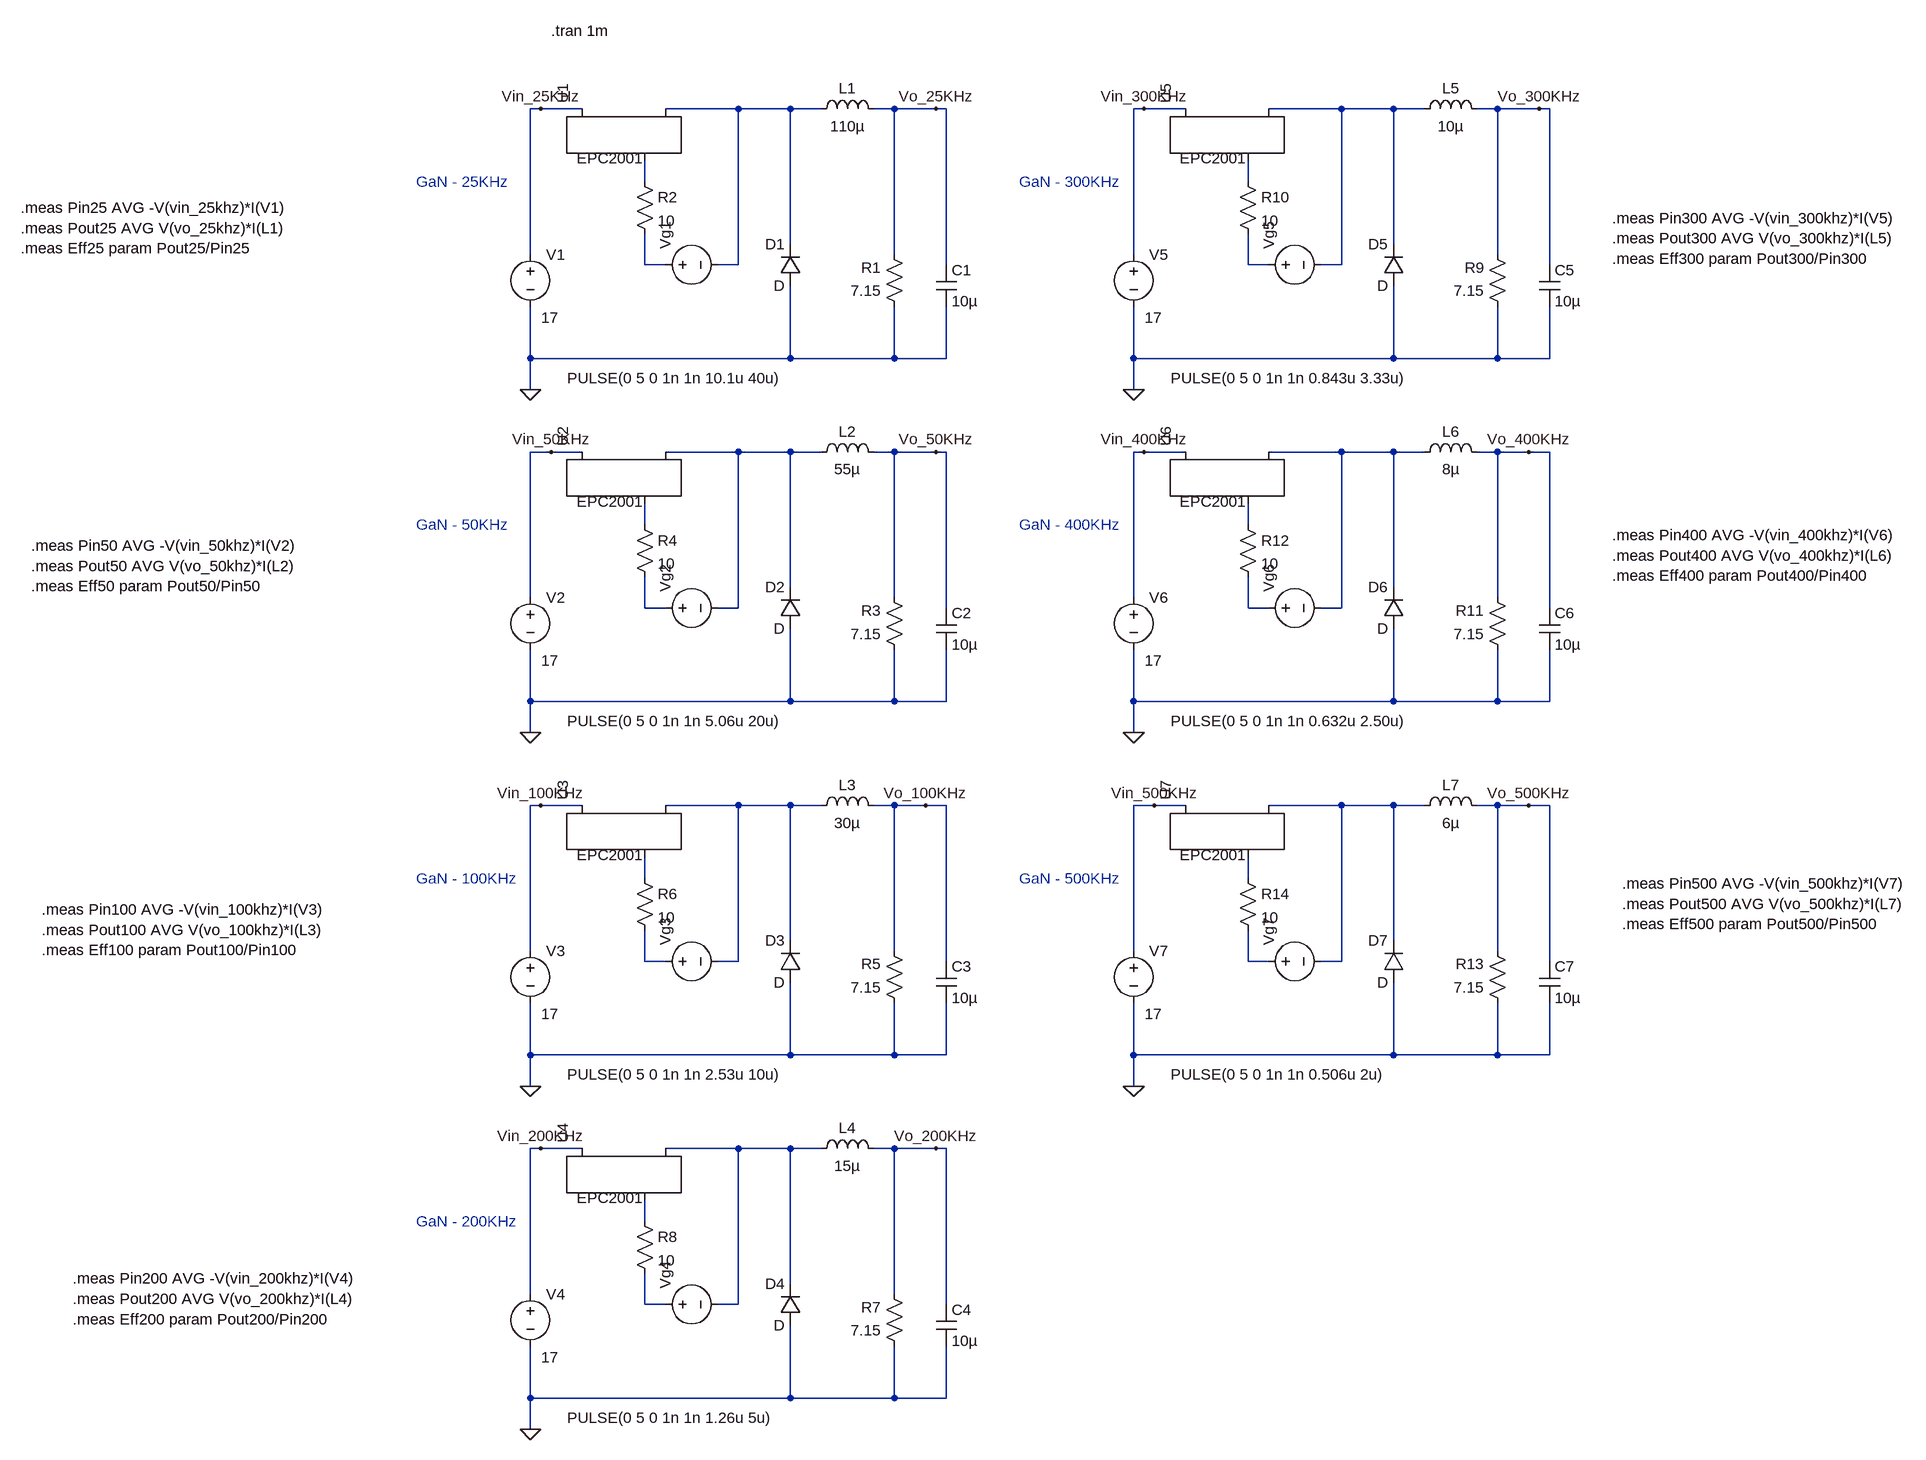
[diagram p0: schematic EPC2001.asc]
EPC2001.asc, the LTspice schematic file:
Version 4
SHEET 1 2764 1364
WIRE 624 -688 608 -688
WIRE 688 -688 624 -688
WIRE 928 -688 816 -688
WIRE 1008 -688 928 -688
WIRE 1056 -688 1008 -688
WIRE 1168 -688 1136 -688
WIRE 1232 -688 1168 -688
WIRE 1248 -688 1232 -688
WIRE 1552 -688 1536 -688
WIRE 1616 -688 1552 -688
WIRE 1856 -688 1744 -688
WIRE 1936 -688 1856 -688
WIRE 1984 -688 1936 -688
WIRE 2096 -688 2064 -688
WIRE 2160 -688 2096 -688
WIRE 2176 -688 2160 -688
WIRE 784 -576 784 -608
WIRE 1712 -576 1712 -608
WIRE 1008 -480 1008 -688
WIRE 1936 -480 1936 -688
WIRE 608 -464 608 -688
WIRE 1168 -464 1168 -688
WIRE 1536 -464 1536 -688
WIRE 2096 -464 2096 -688
WIRE 784 -448 784 -496
WIRE 816 -448 784 -448
WIRE 928 -448 928 -688
WIRE 928 -448 896 -448
WIRE 1248 -448 1248 -688
WIRE 1712 -448 1712 -496
WIRE 1744 -448 1712 -448
WIRE 1856 -448 1856 -688
WIRE 1856 -448 1824 -448
WIRE 2176 -448 2176 -688
WIRE 608 -304 608 -384
WIRE 1008 -304 1008 -416
WIRE 1008 -304 608 -304
WIRE 1168 -304 1168 -384
WIRE 1168 -304 1008 -304
WIRE 1248 -304 1248 -384
WIRE 1248 -304 1168 -304
WIRE 1536 -304 1536 -384
WIRE 1936 -304 1936 -416
WIRE 1936 -304 1536 -304
WIRE 2096 -304 2096 -384
WIRE 2096 -304 1936 -304
WIRE 2176 -304 2176 -384
WIRE 2176 -304 2096 -304
WIRE 608 -256 608 -304
WIRE 1536 -256 1536 -304
WIRE 640 -160 608 -160
WIRE 688 -160 640 -160
WIRE 928 -160 816 -160
WIRE 1008 -160 928 -160
WIRE 1056 -160 1008 -160
WIRE 1168 -160 1136 -160
WIRE 1232 -160 1168 -160
WIRE 1248 -160 1232 -160
WIRE 1552 -160 1536 -160
WIRE 1616 -160 1552 -160
WIRE 1856 -160 1744 -160
WIRE 1936 -160 1856 -160
WIRE 1984 -160 1936 -160
WIRE 2096 -160 2064 -160
WIRE 2144 -160 2096 -160
WIRE 2176 -160 2144 -160
WIRE 784 -48 784 -80
WIRE 1712 -48 1712 -80
WIRE 1008 48 1008 -160
WIRE 1936 48 1936 -160
WIRE 608 64 608 -160
WIRE 1168 64 1168 -160
WIRE 1536 64 1536 -160
WIRE 2096 64 2096 -160
WIRE 784 80 784 32
WIRE 816 80 784 80
WIRE 928 80 928 -160
WIRE 928 80 896 80
WIRE 1248 80 1248 -160
WIRE 1712 80 1712 32
WIRE 1744 80 1712 80
WIRE 1856 80 1856 -160
WIRE 1856 80 1824 80
WIRE 2176 80 2176 -160
WIRE 608 224 608 144
WIRE 1008 224 1008 112
WIRE 1008 224 608 224
WIRE 1168 224 1168 144
WIRE 1168 224 1008 224
WIRE 1248 224 1248 144
WIRE 1248 224 1168 224
WIRE 1536 224 1536 144
WIRE 1936 224 1936 112
WIRE 1936 224 1536 224
WIRE 2096 224 2096 144
WIRE 2096 224 1936 224
WIRE 2176 224 2176 144
WIRE 2176 224 2096 224
WIRE 608 272 608 224
WIRE 1536 272 1536 224
WIRE 624 384 608 384
WIRE 688 384 624 384
WIRE 928 384 816 384
WIRE 1008 384 928 384
WIRE 1056 384 1008 384
WIRE 1168 384 1136 384
WIRE 1216 384 1168 384
WIRE 1248 384 1216 384
WIRE 1568 384 1536 384
WIRE 1616 384 1568 384
WIRE 1856 384 1744 384
WIRE 1936 384 1856 384
WIRE 1984 384 1936 384
WIRE 2096 384 2064 384
WIRE 2144 384 2096 384
WIRE 2176 384 2144 384
WIRE 784 496 784 464
WIRE 1712 496 1712 464
WIRE 1008 592 1008 384
WIRE 1936 592 1936 384
WIRE 608 608 608 384
WIRE 1168 608 1168 384
WIRE 1536 608 1536 384
WIRE 2096 608 2096 384
WIRE 784 624 784 576
WIRE 816 624 784 624
WIRE 928 624 928 384
WIRE 928 624 896 624
WIRE 1248 624 1248 384
WIRE 1712 624 1712 576
WIRE 1744 624 1712 624
WIRE 1856 624 1856 384
WIRE 1856 624 1824 624
WIRE 2176 624 2176 384
WIRE 608 768 608 688
WIRE 1008 768 1008 656
WIRE 1008 768 608 768
WIRE 1168 768 1168 688
WIRE 1168 768 1008 768
WIRE 1248 768 1248 688
WIRE 1248 768 1168 768
WIRE 1536 768 1536 688
WIRE 1936 768 1936 656
WIRE 1936 768 1536 768
WIRE 2096 768 2096 688
WIRE 2096 768 1936 768
WIRE 2176 768 2176 688
WIRE 2176 768 2096 768
WIRE 608 816 608 768
WIRE 1536 816 1536 768
WIRE 624 912 608 912
WIRE 688 912 624 912
WIRE 928 912 816 912
WIRE 1008 912 928 912
WIRE 1056 912 1008 912
WIRE 1168 912 1136 912
WIRE 1232 912 1168 912
WIRE 1248 912 1232 912
WIRE 784 1024 784 992
WIRE 1008 1120 1008 912
WIRE 608 1136 608 912
WIRE 1168 1136 1168 912
WIRE 784 1152 784 1104
WIRE 816 1152 784 1152
WIRE 928 1152 928 912
WIRE 928 1152 896 1152
WIRE 1248 1152 1248 912
WIRE 608 1296 608 1216
WIRE 1008 1296 1008 1184
WIRE 1008 1296 608 1296
WIRE 1168 1296 1168 1216
WIRE 1168 1296 1008 1296
WIRE 1248 1296 1248 1216
WIRE 1248 1296 1168 1296
WIRE 608 1344 608 1296
FLAG 608 -256 0
FLAG 608 272 0
FLAG 608 816 0
FLAG 608 1344 0
FLAG 1536 -256 0
FLAG 1536 272 0
FLAG 1536 816 0
FLAG 1232 -688 Vo_25KHz
FLAG 1232 -160 Vo_50KHz
FLAG 1216 384 Vo_100KHz
FLAG 1232 912 Vo_200KHz
FLAG 2144 384 Vo_500KHz
FLAG 2144 -160 Vo_400KHz
FLAG 2160 -688 Vo_300KHz
FLAG 624 -688 Vin_25KHz
FLAG 640 -160 Vin_50KHz
FLAG 624 384 Vin_100KHz
FLAG 624 912 Vin_200KHz
FLAG 1552 -688 Vin_300KHz
FLAG 1552 -160 Vin_400KHz
FLAG 1568 384 Vin_500KHz
SYMBOL voltage 800 -448 R270
WINDOW 3 -174 -135 VRight 2
WINDOW 123 0 0 Left 2
SYMATTR Value PULSE(0 5 0 1n 1n 10.1u 40u)
SYMATTR SpiceLine Rser=2
SYMATTR InstName Vg1
SYMBOL voltage 608 -480 R0
WINDOW 123 0 0 Left 2
WINDOW 3 17 113 Left 2
SYMATTR Value 17
SYMATTR SpiceLine Rser=0
SYMATTR InstName V1
SYMBOL EPCGaN 784 -608 R270
WINDOW 3 4 -105 VRight 2
SYMATTR Value EPC2001
SYMATTR InstName U1
SYMBOL diode 1024 -416 R180
WINDOW 0 24 64 Left 2
WINDOW 3 24 0 Left 2
SYMATTR InstName D1
SYMBOL ind 1040 -672 R270
WINDOW 0 32 56 VTop 2
WINDOW 3 5 56 VBottom 2
SYMATTR InstName L1
SYMATTR Value 110µ
SYMBOL res 1184 -368 R180
WINDOW 0 36 76 Left 2
WINDOW 3 36 40 Left 2
SYMATTR InstName R1
SYMATTR Value 7.15
SYMBOL cap 1232 -448 R0
SYMATTR InstName C1
SYMATTR Value 10µ
SYMBOL res 768 -592 R0
SYMATTR InstName R2
SYMATTR Value 10
SYMBOL voltage 800 80 R270
WINDOW 3 -174 -135 VRight 2
WINDOW 123 0 0 Left 2
SYMATTR Value PULSE(0 5 0 1n 1n 5.06u 20u)
SYMATTR SpiceLine Rser=2
SYMATTR InstName Vg2
SYMBOL voltage 608 48 R0
WINDOW 123 0 0 Left 2
WINDOW 3 17 113 Left 2
SYMATTR Value 17
SYMATTR SpiceLine Rser=0
SYMATTR InstName V2
SYMBOL EPCGaN 784 -80 R270
WINDOW 3 4 -105 VRight 2
SYMATTR Value EPC2001
SYMATTR InstName U2
SYMBOL diode 1024 112 R180
WINDOW 0 24 64 Left 2
WINDOW 3 24 0 Left 2
SYMATTR InstName D2
SYMBOL ind 1040 -144 R270
WINDOW 0 32 56 VTop 2
WINDOW 3 5 56 VBottom 2
SYMATTR InstName L2
SYMATTR Value 55µ
SYMBOL res 1184 160 R180
WINDOW 0 36 76 Left 2
WINDOW 3 36 40 Left 2
SYMATTR InstName R3
SYMATTR Value 7.15
SYMBOL cap 1232 80 R0
SYMATTR InstName C2
SYMATTR Value 10µ
SYMBOL res 768 -64 R0
SYMATTR InstName R4
SYMATTR Value 10
SYMBOL voltage 800 624 R270
WINDOW 3 -174 -135 VRight 2
WINDOW 123 0 0 Left 2
SYMATTR Value PULSE(0 5 0 1n 1n 2.53u 10u)
SYMATTR SpiceLine Rser=2
SYMATTR InstName Vg3
SYMBOL voltage 608 592 R0
WINDOW 123 0 0 Left 2
WINDOW 3 17 113 Left 2
SYMATTR Value 17
SYMATTR SpiceLine Rser=0
SYMATTR InstName V3
SYMBOL EPCGaN 784 464 R270
WINDOW 3 4 -105 VRight 2
SYMATTR Value EPC2001
SYMATTR InstName U3
SYMBOL diode 1024 656 R180
WINDOW 0 24 64 Left 2
WINDOW 3 24 0 Left 2
SYMATTR InstName D3
SYMBOL ind 1040 400 R270
WINDOW 0 32 56 VTop 2
WINDOW 3 5 56 VBottom 2
SYMATTR InstName L3
SYMATTR Value 30µ
SYMBOL res 1184 704 R180
WINDOW 0 36 76 Left 2
WINDOW 3 36 40 Left 2
SYMATTR InstName R5
SYMATTR Value 7.15
SYMBOL cap 1232 624 R0
SYMATTR InstName C3
SYMATTR Value 10µ
SYMBOL res 768 480 R0
SYMATTR InstName R6
SYMATTR Value 10
SYMBOL voltage 800 1152 R270
WINDOW 3 -174 -135 VRight 2
WINDOW 123 0 0 Left 2
SYMATTR Value PULSE(0 5 0 1n 1n 1.26u 5u)
SYMATTR SpiceLine Rser=2
SYMATTR InstName Vg4
SYMBOL voltage 608 1120 R0
WINDOW 123 0 0 Left 2
WINDOW 3 17 113 Left 2
SYMATTR Value 17
SYMATTR SpiceLine Rser=0
SYMATTR InstName V4
SYMBOL EPCGaN 784 992 R270
WINDOW 3 4 -105 VRight 2
SYMATTR Value EPC2001
SYMATTR InstName U4
SYMBOL diode 1024 1184 R180
WINDOW 0 24 64 Left 2
WINDOW 3 24 0 Left 2
SYMATTR InstName D4
SYMBOL ind 1040 928 R270
WINDOW 0 32 56 VTop 2
WINDOW 3 5 56 VBottom 2
SYMATTR InstName L4
SYMATTR Value 15µ
SYMBOL res 1184 1232 R180
WINDOW 0 36 76 Left 2
WINDOW 3 36 40 Left 2
SYMATTR InstName R7
SYMATTR Value 7.15
SYMBOL cap 1232 1152 R0
SYMATTR InstName C4
SYMATTR Value 10µ
SYMBOL res 768 1008 R0
SYMATTR InstName R8
SYMATTR Value 10
SYMBOL voltage 1728 -448 R270
WINDOW 3 -174 -135 VRight 2
WINDOW 123 0 0 Left 2
SYMATTR Value PULSE(0 5 0 1n 1n 0.843u 3.33u)
SYMATTR SpiceLine Rser=2
SYMATTR InstName Vg5
SYMBOL voltage 1536 -480 R0
WINDOW 123 0 0 Left 2
WINDOW 3 17 113 Left 2
SYMATTR Value 17
SYMATTR SpiceLine Rser=0
SYMATTR InstName V5
SYMBOL EPCGaN 1712 -608 R270
WINDOW 3 4 -105 VRight 2
SYMATTR Value EPC2001
SYMATTR InstName U5
SYMBOL diode 1952 -416 R180
WINDOW 0 24 64 Left 2
WINDOW 3 24 0 Left 2
SYMATTR InstName D5
SYMBOL ind 1968 -672 R270
WINDOW 0 32 56 VTop 2
WINDOW 3 5 56 VBottom 2
SYMATTR InstName L5
SYMATTR Value 10µ
SYMBOL res 2112 -368 R180
WINDOW 0 36 76 Left 2
WINDOW 3 36 40 Left 2
SYMATTR InstName R9
SYMATTR Value 7.15
SYMBOL cap 2160 -448 R0
SYMATTR InstName C5
SYMATTR Value 10µ
SYMBOL res 1696 -592 R0
SYMATTR InstName R10
SYMATTR Value 10
SYMBOL voltage 1728 80 R270
WINDOW 3 -174 -135 VRight 2
WINDOW 123 0 0 Left 2
SYMATTR Value PULSE(0 5 0 1n 1n 0.632u 2.50u)
SYMATTR SpiceLine Rser=2
SYMATTR InstName Vg6
SYMBOL voltage 1536 48 R0
WINDOW 123 0 0 Left 2
WINDOW 3 17 113 Left 2
SYMATTR Value 17
SYMATTR SpiceLine Rser=0
SYMATTR InstName V6
SYMBOL EPCGaN 1712 -80 R270
WINDOW 3 4 -105 VRight 2
SYMATTR Value EPC2001
SYMATTR InstName U6
SYMBOL diode 1952 112 R180
WINDOW 0 24 64 Left 2
WINDOW 3 24 0 Left 2
SYMATTR InstName D6
SYMBOL ind 1968 -144 R270
WINDOW 0 32 56 VTop 2
WINDOW 3 5 56 VBottom 2
SYMATTR InstName L6
SYMATTR Value 8µ
SYMBOL res 2112 160 R180
WINDOW 0 36 76 Left 2
WINDOW 3 36 40 Left 2
SYMATTR InstName R11
SYMATTR Value 7.15
SYMBOL cap 2160 80 R0
SYMATTR InstName C6
SYMATTR Value 10µ
SYMBOL res 1696 -64 R0
SYMATTR InstName R12
SYMATTR Value 10
SYMBOL voltage 1728 624 R270
WINDOW 3 -174 -135 VRight 2
WINDOW 123 0 0 Left 2
SYMATTR Value PULSE(0 5 0 1n 1n 0.506u 2u)
SYMATTR SpiceLine Rser=2
SYMATTR InstName Vg7
SYMBOL voltage 1536 592 R0
WINDOW 123 0 0 Left 2
WINDOW 3 17 113 Left 2
SYMATTR Value 17
SYMATTR SpiceLine Rser=0
SYMATTR InstName V7
SYMBOL EPCGaN 1712 464 R270
WINDOW 3 4 -105 VRight 2
SYMATTR Value EPC2001
SYMATTR InstName U7
SYMBOL diode 1952 656 R180
WINDOW 0 24 64 Left 2
WINDOW 3 24 0 Left 2
SYMATTR InstName D7
SYMBOL ind 1968 400 R270
WINDOW 0 32 56 VTop 2
WINDOW 3 5 56 VBottom 2
SYMATTR InstName L7
SYMATTR Value 6µ
SYMBOL res 2112 704 R180
WINDOW 0 36 76 Left 2
WINDOW 3 36 40 Left 2
SYMATTR InstName R13
SYMATTR Value 7.15
SYMBOL cap 2160 624 R0
SYMATTR InstName C7
SYMATTR Value 10µ
SYMBOL res 1696 480 R0
SYMATTR InstName R14
SYMATTR Value 10
TEXT 640 -808 Left 2 !.tran 1m
TEXT 432 -576 Left 2 ;GaN - 25KHz
TEXT 432 -48 Left 2 ;GaN - 50KHz
TEXT 432 496 Left 2 ;GaN - 100KHz
TEXT 432 1024 Left 2 ;GaN - 200KHz
TEXT 1360 -576 Left 2 ;GaN - 300KHz
TEXT 1360 -48 Left 2 ;GaN - 400KHz
TEXT 1360 496 Left 2 ;GaN - 500KHz
TEXT -176 -536 Left 2 !.meas Pin25 AVG -V(vin_25khz)*I(V1)\n.meas Pout25 AVG V(vo_25khz)*I(L1)\n.meas Eff25 param Pout25/Pin25
TEXT -160 -16 Left 2 !.meas Pin50 AVG -V(vin_50khz)*I(V2)\n.meas Pout50 AVG V(vo_50khz)*I(L2)\n.meas Eff50 param Pout50/Pin50
TEXT -144 544 Left 2 !.meas Pin100 AVG -V(vin_100khz)*I(V3)\n.meas Pout100 AVG V(vo_100khz)*I(L3)\n.meas Eff100 param Pout100/Pin100
TEXT -96 1112 Left 2 !.meas Pin200 AVG -V(vin_200khz)*I(V4)\n.meas Pout200 AVG V(vo_200khz)*I(L4)\n.meas Eff200 param Pout200/Pin200
TEXT 2272 -520 Left 2 !.meas Pin300 AVG -V(vin_300khz)*I(V5)\n.meas Pout300 AVG V(vo_300khz)*I(L5)\n.meas Eff300 param Pout300/Pin300
TEXT 2272 -32 Left 2 !.meas Pin400 AVG -V(vin_400khz)*I(V6)\n.meas Pout400 AVG V(vo_400khz)*I(L6)\n.meas Eff400 param Pout400/Pin400
TEXT 2288 504 Left 2 !.meas Pin500 AVG -V(vin_500khz)*I(V7)\n.meas Pout500 AVG V(vo_500khz)*I(L7)\n.meas Eff500 param Pout500/Pin500

The netlist it stands for:
* EPC2001.asc
Vg1 N005 N001 PULSE(0 5 0 1n 1n 10.1u 40u) Rser=2
V1 Vin_25KHz 0 17 Rser=0
XU1 N003 Vin_25KHz N001 EPC2001
D1 0 N001 D
L1 N001 Vo_25KHz 110µ
R1 0 Vo_25KHz 7.15
C1 Vo_25KHz 0 10µ
R2 N003 N005 10
Vg2 N011 N007 PULSE(0 5 0 1n 1n 5.06u 20u) Rser=2
V2 Vin_50KHz 0 17 Rser=0
XU2 N009 Vin_50KHz N007 EPC2001
D2 0 N007 D
L2 N007 Vo_50KHz 55µ
R3 0 Vo_50KHz 7.15
C2 Vo_50KHz 0 10µ
R4 N009 N011 10
Vg3 N017 N013 PULSE(0 5 0 1n 1n 2.53u 10u) Rser=2
V3 Vin_100KHz 0 17 Rser=0
XU3 N015 Vin_100KHz N013 EPC2001
D3 0 N013 D
L3 N013 Vo_100KHz 30µ
R5 0 Vo_100KHz 7.15
C3 Vo_100KHz 0 10µ
R6 N015 N017 10
Vg4 N021 N019 PULSE(0 5 0 1n 1n 1.26u 5u) Rser=2
V4 Vin_200KHz 0 17 Rser=0
XU4 N020 Vin_200KHz N019 EPC2001
D4 0 N019 D
L4 N019 Vo_200KHz 15µ
R7 0 Vo_200KHz 7.15
C4 Vo_200KHz 0 10µ
R8 N020 N021 10
Vg5 N006 N002 PULSE(0 5 0 1n 1n 0.843u 3.33u) Rser=2
V5 Vin_300KHz 0 17 Rser=0
XU5 N004 Vin_300KHz N002 EPC2001
D5 0 N002 D
L5 N002 Vo_300KHz 10µ
R9 0 Vo_300KHz 7.15
C5 Vo_300KHz 0 10µ
R10 N004 N006 10
Vg6 N012 N008 PULSE(0 5 0 1n 1n 0.632u 2.50u) Rser=2
V6 Vin_400KHz 0 17 Rser=0
XU6 N010 Vin_400KHz N008 EPC2001
D6 0 N008 D
L6 N008 Vo_400KHz 8µ
R11 0 Vo_400KHz 7.15
C6 Vo_400KHz 0 10µ
R12 N010 N012 10
Vg7 N018 N014 PULSE(0 5 0 1n 1n 0.506u 2u) Rser=2
V7 Vin_500KHz 0 17 Rser=0
XU7 N016 Vin_500KHz N014 EPC2001
D7 0 N014 D
L7 N014 Vo_500KHz 6µ
R13 0 Vo_500KHz 7.15
C7 Vo_500KHz 0 10µ
R14 N016 N018 10
.model D D
.lib standard.dio
.tran 1m
* GaN - 25KHz
* GaN - 50KHz
* GaN - 100KHz
* GaN - 200KHz
* GaN - 300KHz
* GaN - 400KHz
* GaN - 500KHz
.meas Pin25 AVG -V(vin_25khz)*I(V1)
.meas Pout25 AVG V(vo_25khz)*I(L1)
.meas Eff25 param Pout25/Pin25
.meas Pin50 AVG -V(vin_50khz)*I(V2)
.meas Pout50 AVG V(vo_50khz)*I(L2)
.meas Eff50 param Pout50/Pin50
.meas Pin100 AVG -V(vin_100khz)*I(V3)
.meas Pout100 AVG V(vo_100khz)*I(L3)
.meas Eff100 param Pout100/Pin100
.meas Pin200 AVG -V(vin_200khz)*I(V4)
.meas Pout200 AVG V(vo_200khz)*I(L4)
.meas Eff200 param Pout200/Pin200
.meas Pin300 AVG -V(vin_300khz)*I(V5)
.meas Pout300 AVG V(vo_300khz)*I(L5)
.meas Eff300 param Pout300/Pin300
.meas Pin400 AVG -V(vin_400khz)*I(V6)
.meas Pout400 AVG V(vo_400khz)*I(L6)
.meas Eff400 param Pout400/Pin400
.meas Pin500 AVG -V(vin_500khz)*I(V7)
.meas Pout500 AVG V(vo_500khz)*I(L7)
.meas Eff500 param Pout500/Pin500
.backanno
.end